# EAGLE design 3 valve front connect (EAGLE 9.2.2)
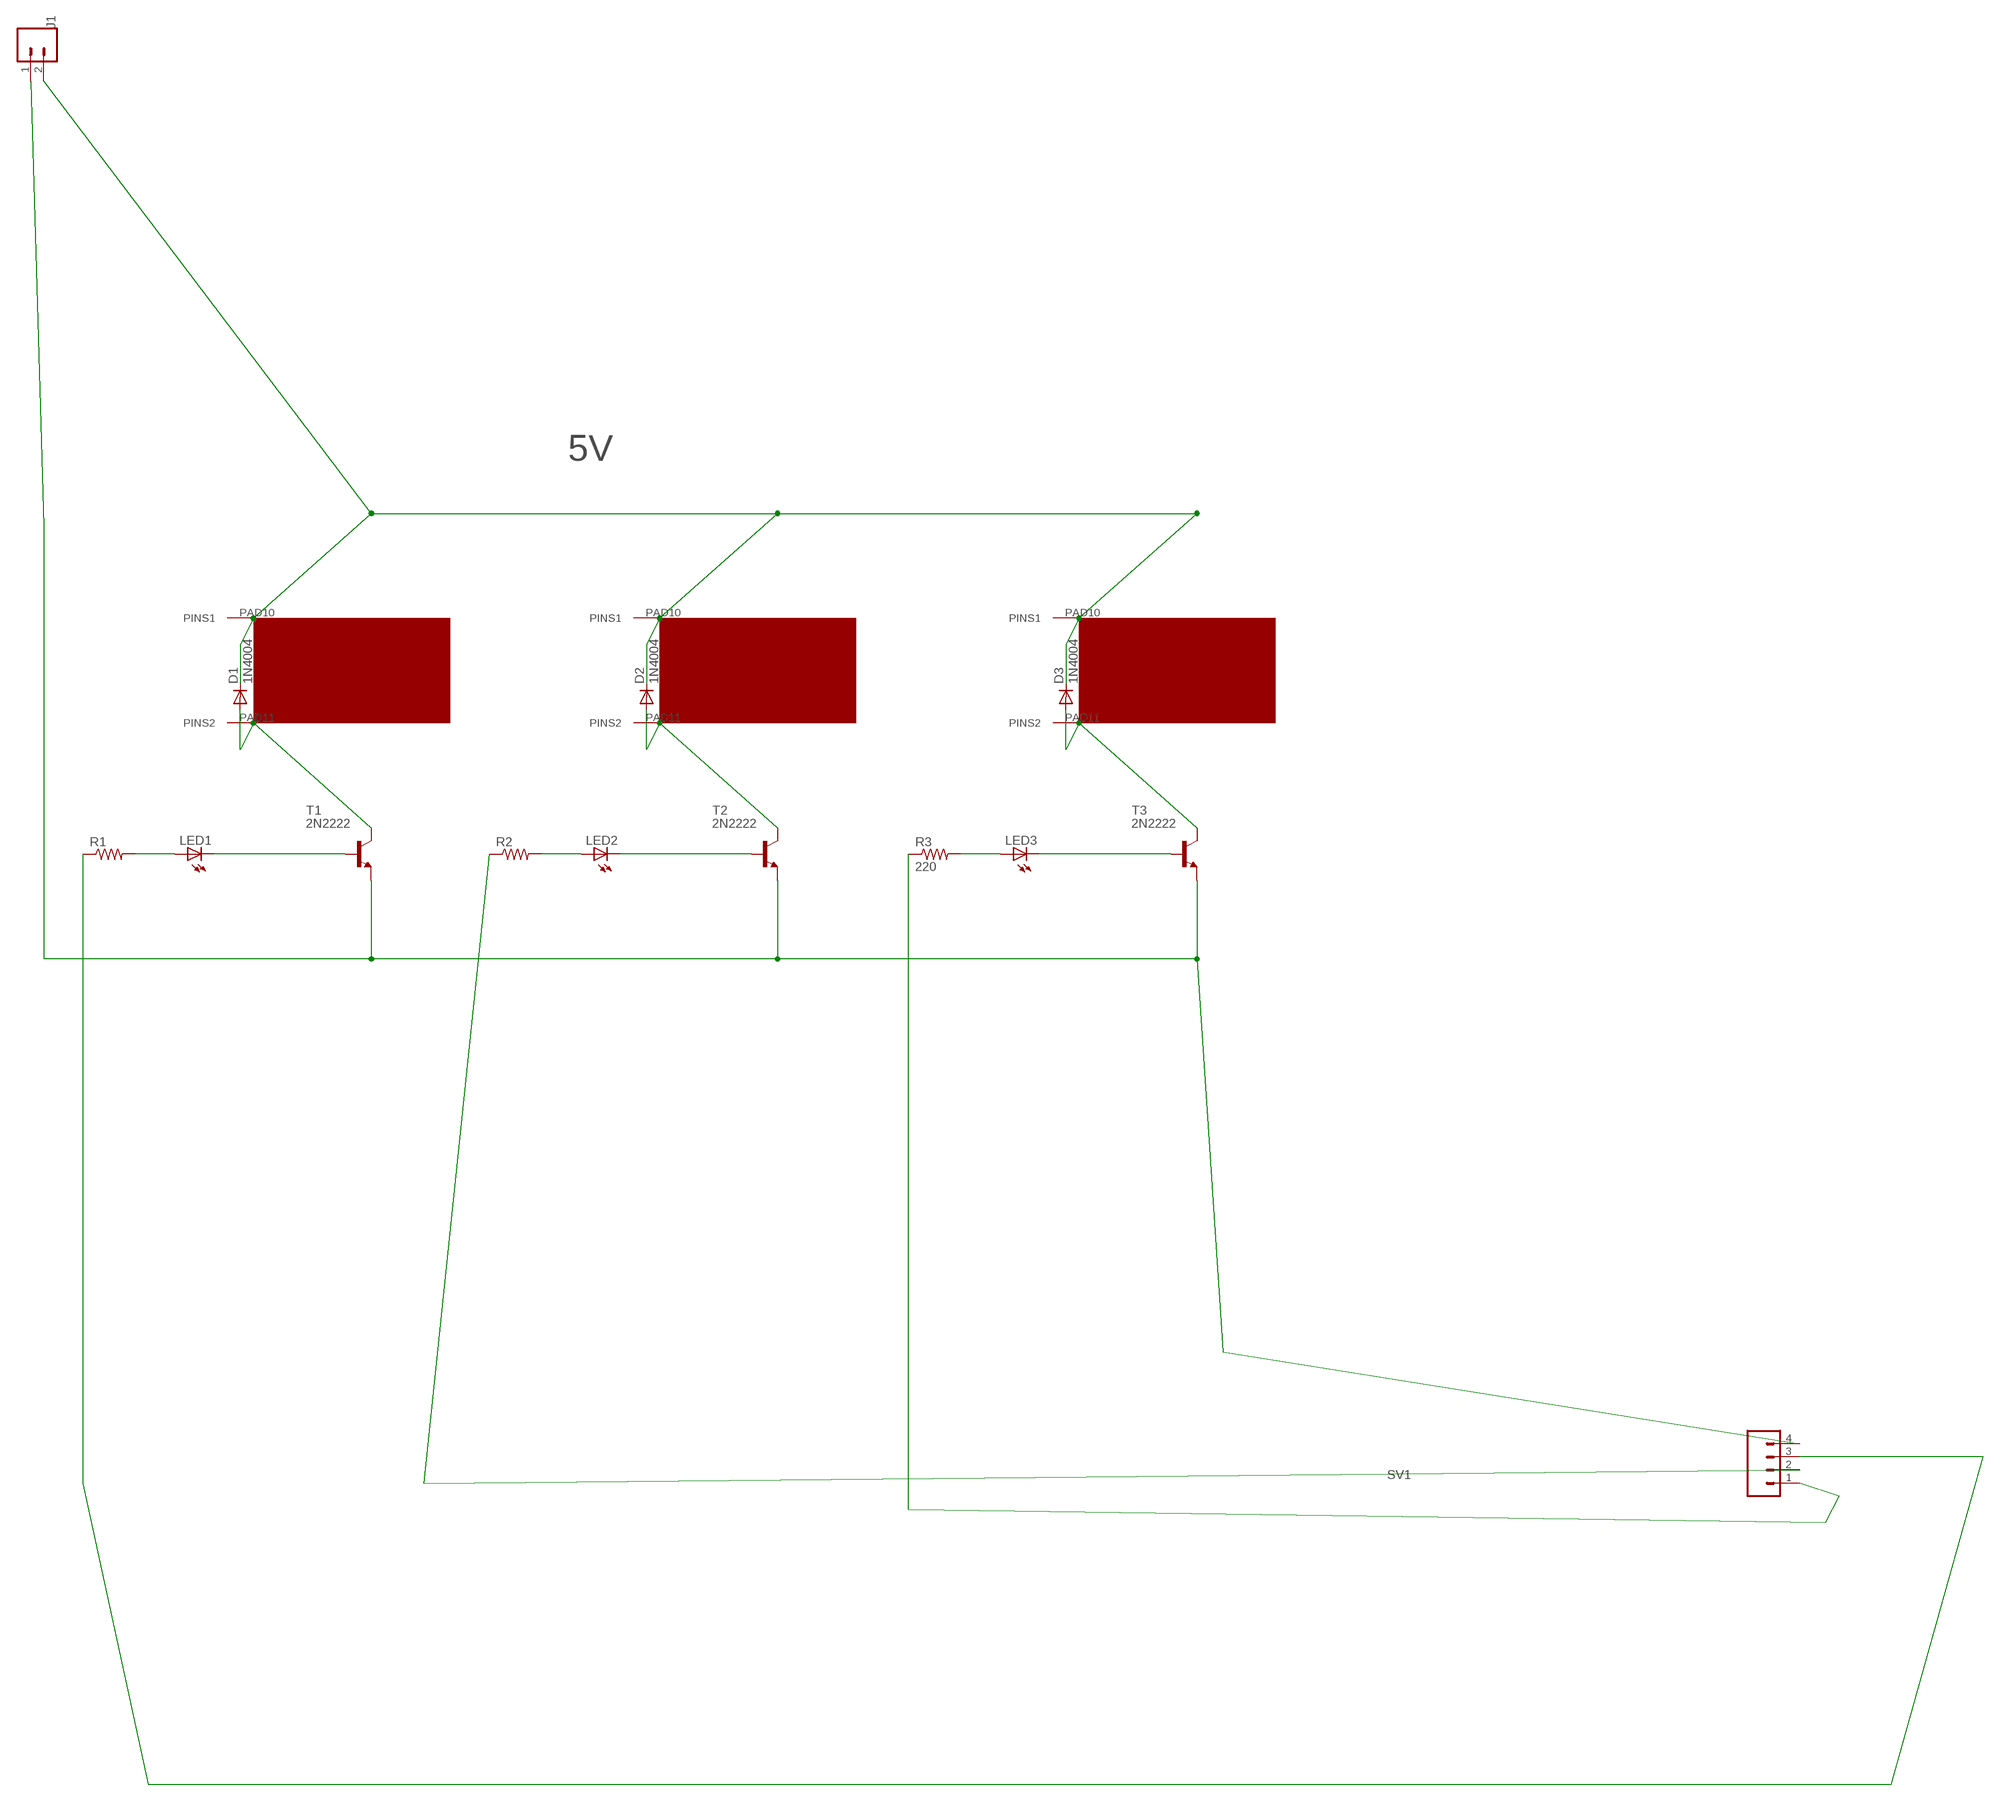
[diagram p0: schematic, sheet 1]

## Parts
D1  1N4004  [DO41-10]
D2  1N4004  [DO41-10]
D3  1N4004  [DO41-10]
J1  CONN_023.5MM  [SCREWTERMINAL-3.5MM-2]
LED1  LED5MM  [LED5MM]
LED2  LED5MM  [LED5MM]
LED3  LED5MM  [LED5MM]
R1  R-US_0207/10  [0207/10]
R2  R-US_0207/10  [0207/10]
R3  220  R-US_0207/10  [0207/10]
SV1  CONN_04  [1X04]
T1  2N2222  [TO92-EBC-OVAL]
T2  2N2222  [TO92-EBC-OVAL]
T3  2N2222  [TO92-EBC-OVAL]
U$1  VALVE  [VALVTEST2]
U$2  VALVE  [VALVTEST2]
VALVE3  VALVE  [VALVTEST2]

## Nets
5V: D1.C D2.C D3.C J1.2 U$1.PAD10(PINS1) U$2.PAD10(PINS1) VALVE3.PAD10(PINS1)
GND: J1.1 SV1.4 T1.E T2.E T3.E
N$1: D1.A T1.C U$1.PAD11(PINS2)
N$2: LED1.K(C) T1.B
N$3: LED1.A R1.2
N$5: D2.A T2.C U$2.PAD11(PINS2)
N$6: LED2.K(C) T2.B
N$7: LED2.A R2.2
N$9: D3.A T3.C VALVE3.PAD11(PINS2)
N$10: LED3.K(C) T3.B
N$11: LED3.A R3.2
N$19: R3.1 SV1.1
N$30: R1.1 SV1.3
N$44: R2.1 SV1.2

## Library data of the parts
D1-D3 = adafruit:1N4004: DIODE General purpose 1N400x type rectifier (With bigger pads) http://www.ladyada.net/library/pcb/eaglelibrary.html
J1 = SparkFun-Connectors:CONN_02: Multi connection point. Often used as Generic Header-pin footprint for 0.1 inch spaced/style header connections On any of the 0.1 inch spaced packages, you can populate with these: Break Away Headers - Straight <https://www.sparkfun.com/products/116> (PRT-00116) Break Away Male Headers - Right Angle <https://www.sparkfun.com/products/553> (PRT-00553) Female Headers <https://www.sparkfun.com/products/115> (PRT-00115) Break Away Headers - Machine Pin <https://www.sparkfun.com/products/117> (PRT-00117) Break Away Female Headers - Swiss Machine Pin <https://www.sparkfun.com/products/743> (PRT-00743) For SCREWTERMINALS and SPRING TERMINALS visit here: Screw Terimnals on SparkFun.com <https://www.sparkfun.com/search/results?term=Screw+Terminals> (5mm/3.5mm/2.54mm spacing) This device is also useful as a general connection point to wire up your design to another part of your project. Our various solder wires solder well into these plated through hole pads. Hook-Up Wire - Assortment (Stranded, 22 AWG) <https://www.sparkfun.com/products/11375> (PRT-11375) Hook-Up Wire - Assortment (Solid Core, 22 AWG) <https://www.sparkfun.com/products/11367> (PRT-11367) View the entire wire category on our website here <https://www.sparkfun.com/categories/141> Special notes: Molex polarized connector foot print use with: PRT-08233 with associated crimp pins and housings. 2.54_SCREWTERM for use with PRT-10571. 3.5mm Screw Terminal footprints for PRT-08084 5mm Screw Terminal footprints for use with PRT-08432; PROD_ID: CONN-08399
LED1-LED3 = adafruit:LED: LED OSRAM: - CHIPLED LG R971, LG N971, LY N971, LG Q971, LY Q971, LO R971, LY R971 LH N974, LH R974 LS Q976, LO Q976, LY Q976 LO Q996 - Hyper CHIPLED LW Q18S LB Q993, LB Q99A, LB R99A - SideLED LS A670, LO A670, LY A670, LG A670, LP A670 LB A673, LV A673, LT A673, LW A673 LH A674 LY A675 LS A676, LA A676, LO A676, LY A676, LW A676 LS A679, LY A679, LG A679 - Hyper Micro SIDELED® LS Y876, LA Y876, LO Y876, LY Y876 LT Y87S - SmartLED LW L88C, LW L88S LB L89C, LB L89S, LG L890 LS L89K, LO L89K, LY L89K LS L896, LA L896, LO L896, LY L896 - TOPLED LS T670, LO T670, LY T670, LG T670, LP T670 LSG T670, LSP T670, LSY T670, LOP T670, LYG T670 LG T671, LOG T671, LSG T671 LB T673, LV T673, LT T673, LW T673 LH T674 LS T676, LA T676, LO T676, LY T676, LB T676, LH T676, LSB T676, LW T676 LB T67C, LV T67C, LT T67C, LS T67K, LO T67K, LY T67K, LW E67C LS E67B, LA E67B, LO E67B, LY E67B, LB E67C, LV E67C, LT E67C LW T67C LS T679, LY T679, LG T679 LS T770, LO T770, LY T770, LG T770, LP T770 LB T773, LV T773, LT T773, LW T773 LH T774 LS E675, LA E675, LY E675, LS T675 LS T776, LA T776, LO T776, LY T776, LB T776 LHGB T686 LT T68C, LB T68C - Hyper Mini TOPLED® LB M676 - Mini TOPLED Santana® LG M470 LS M47K, LO M47K, LY M47K Source: http://www.osram.convergy.de/
R1-R3 = adafruit:R-US_: RESISTOR, American symbol
SV1 = SparkFun-Connectors:CONN_04: Multi connection point. Often used as Generic Header-pin footprint for 0.1 inch spaced/style header connections On any of the 0.1 inch spaced packages, you can populate with these: Break Away Headers - Straight <https://www.sparkfun.com/products/116> (PRT-00116) Break Away Male Headers - Right Angle <https://www.sparkfun.com/products/553> (PRT-00553) Female Headers <https://www.sparkfun.com/products/115> (PRT-00115) Break Away Headers - Machine Pin <https://www.sparkfun.com/products/117> (PRT-00117) Break Away Female Headers - Swiss Machine Pin <https://www.sparkfun.com/products/743> (PRT-00743) For SCREWTERMINALS and SPRING TERMINALS visit here: Screw Terimnals on SparkFun.com <https://www.sparkfun.com/search/results?term=Screw+Terminals> (5mm/3.5mm/2.54mm spacing) This device is also useful as a general connection point to wire up your design to another part of your project. Our various solder wires solder well into these plated through hole pads. Hook-Up Wire - Assortment (Stranded, 22 AWG) <https://www.sparkfun.com/products/11375> (PRT-11375) Hook-Up Wire - Assortment (Solid Core, 22 AWG) <https://www.sparkfun.com/products/11367> (PRT-11367) View the entire wire category on our website here <https://www.sparkfun.com/categories/141> Special notes: Molex polarized connector foot print use with SKU : PRT-08231 with associated crimp pins and housings. 1MM SMD Version SKU: PRT-10208; PROD_ID: CONN-09696
T1-T3 = adafruit:2N2222: NPN TRANSISTOR Big oval pads
U$1 U$2 VALVE3 = local eagle library:VALVE: pn eumatic valve

## Board
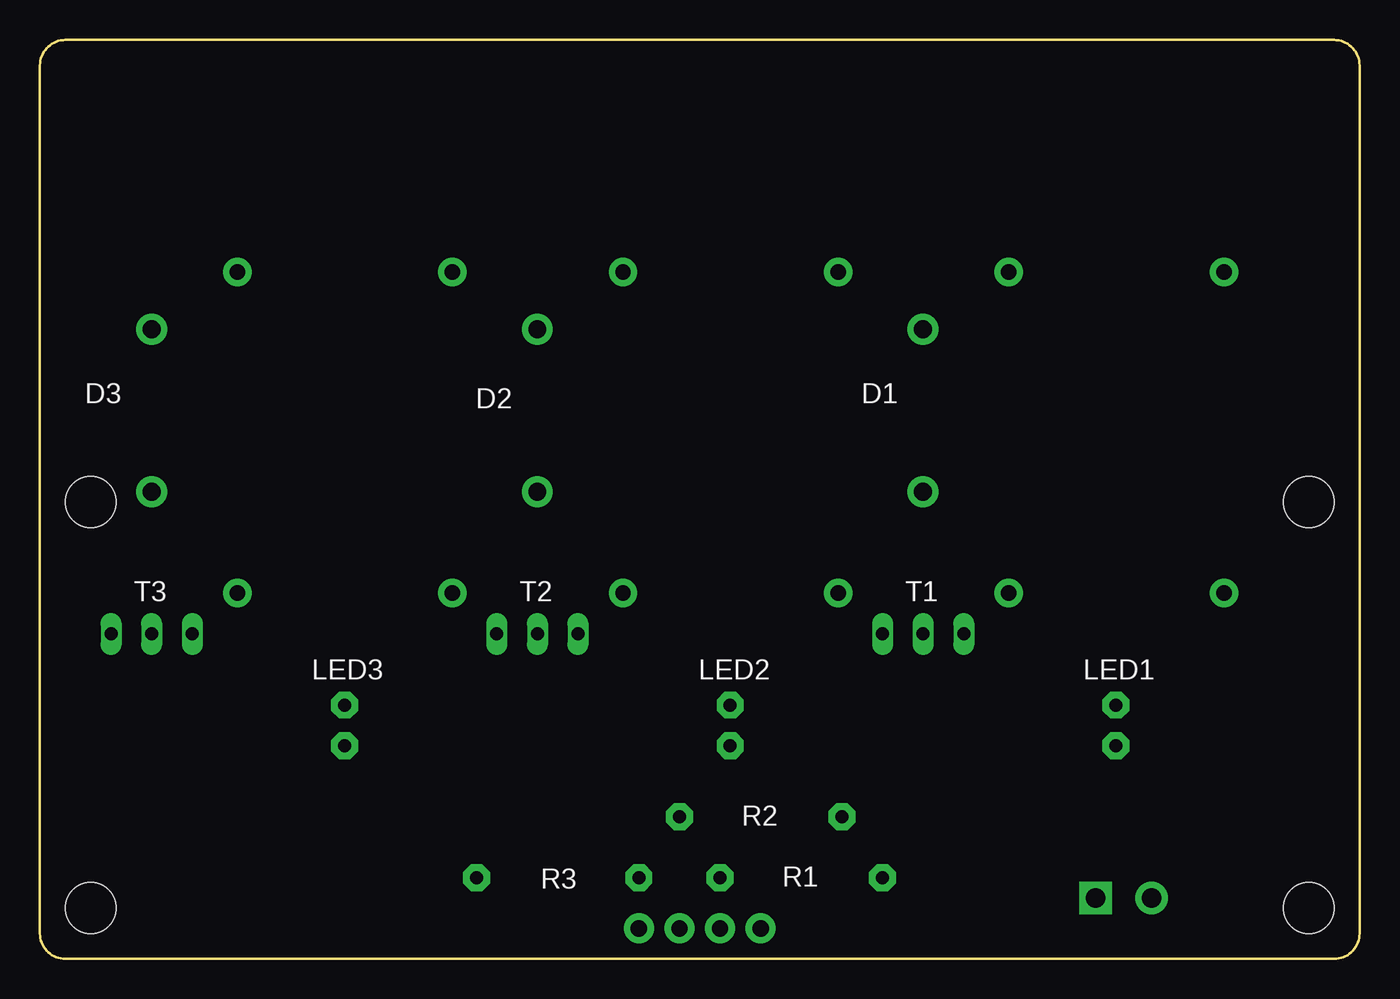
[diagram p1: board, top side]
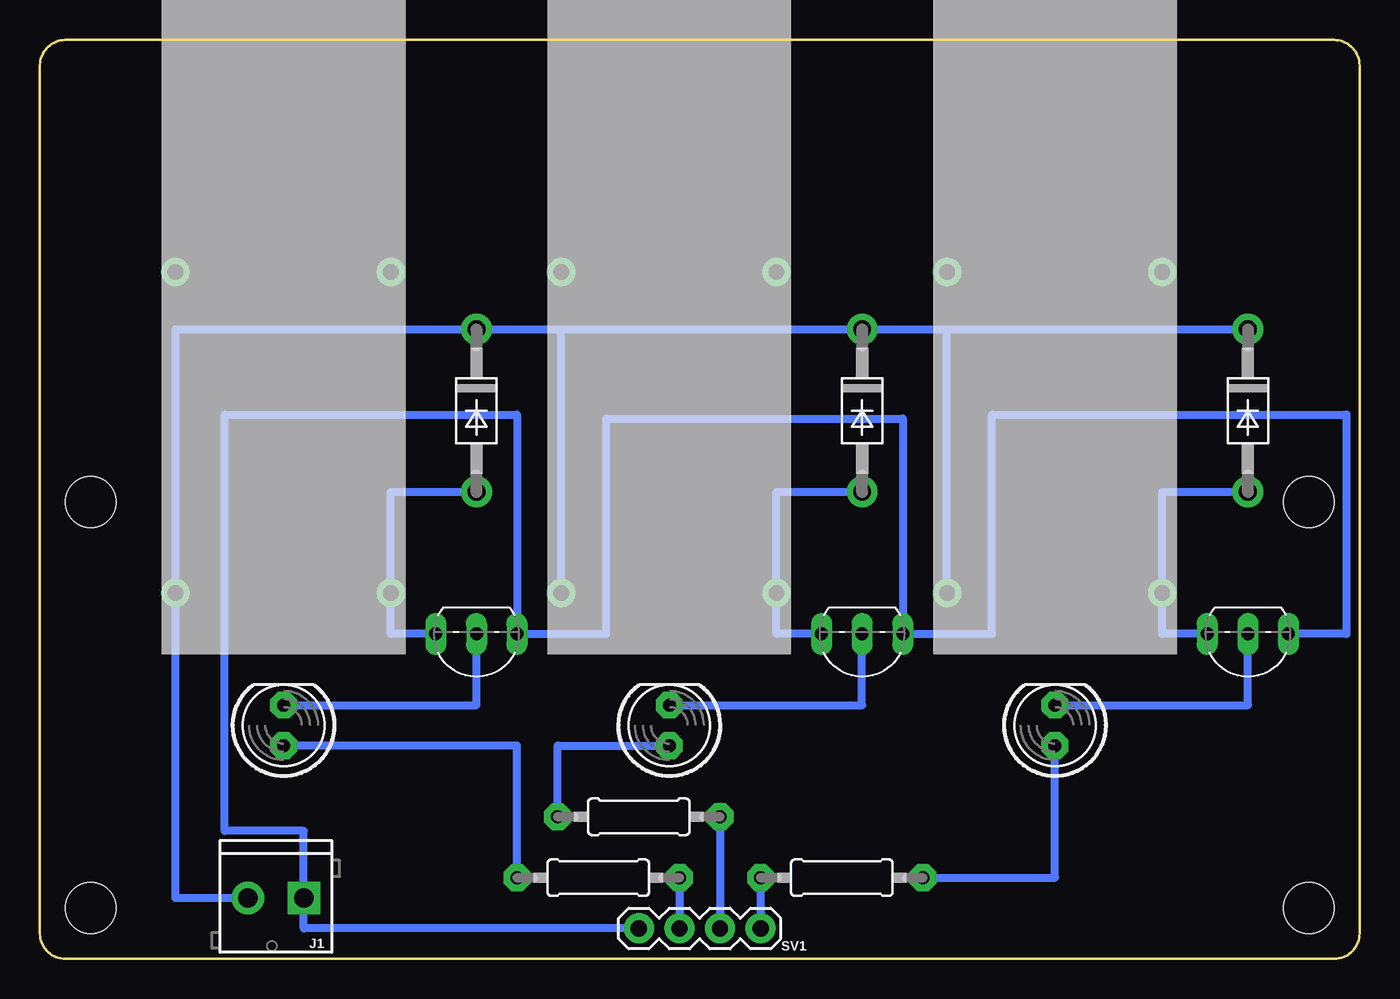
[diagram p2: board, bottom side, seen from below]

Size 82.55 x 57.47 mm. Coordinates in mm from the lower left corner, seen from the top.
Outline: 0,1.59 0,55.88 arc-90 1.59,57.47 80.96,57.47 arc-90 82.55,55.88 82.55,1.59 arc-90 80.96,0 1.59,0 arc-90 0,1.59
Copper layers (1*16): Top 0.035mm / dielectric 1.5mm / Bottom 0.035mm
Design rules "default": minimum track width 6mil, minimum drill 0.35mm, track to track 6mil, track to pad 6mil, pad to pad 6mil, via to via 6mil, smd to smd 6mil, copper to edge 40mil, drill to drill 6mil, minimum pad ring 10mil, minimum via ring 8mil, stop-mask expansion 4mil, vias tented up to drill 0mil, thermal gap 10mil
Holes 3.17 mm at 79.38,3.17 79.38,28.57 3.18,3.17 3.18,28.57

### Footprints (pad centres in the part's own frame; a part is rotated, then mirrored left to right if it is on the bottom)
DO41-10 = drill 1.118 pad 1.93: A 5.08,0; C -5.08,0
SCREWTERMINAL-3.5MM-2 = drill 1.2 pad 2.032 square: 1 0,0 | drill 1.2 pad 2.032: 2 3.5,0
LED5MM = drill 0.813 pad 1.676 octagon: A -1.27,0; K 1.27,0
0207/10 = drill 0.813 pad 1.676 octagon: 1 -5.08,0; 2 5.08,0
1X04 = drill 1.016 pad 1.88: 1 0,0; 2 2.54,0; 3 5.08,0; 4 7.62,0
TO92-EBC-OVAL = drill 0.813 long: B 0,-1.27; C 2.54,-1.27; E -2.54,-1.27
VALVTEST2 = drill 0.965 pad 1.778: PAD10 3.835,-0.864; PAD11 3.835,-14.326; PAD12 23.901,-14.326; PAD13 23.901,-0.864

### Placement (x,y rotation side)
D1  55.25,34.29 270 bottom
D2  31.12,34.29 270 bottom
D3  6.98,34.29 270 bottom
J1  66.04,3.81 180 bottom
LED1  67.31,14.61 90 bottom
LED2  43.18,14.61 90 bottom
LED3  19.05,14.61 90 bottom
R1  47.62,5.08 180 bottom
R2  45.09,8.89 180 bottom
R3  32.39,5.08 0 bottom
SV1  37.47,1.91 180 bottom
T1  55.25,19.05 180 bottom
T2  31.12,19.05 180 bottom
T3  6.98,19.05 180 bottom
U$1  74.93,19.05 90 bottom
U$2  50.8,19.05 90 bottom
VALVE3  26.67,19.05 90 bottom

### Tracks (layer width: path | path; a pad name or v marks a point on that pad's centre or on a via)
5V
  Bottom 0.508: J1.2 74.07,3.81 U$1.PAD10 74.07,39.37 D1.C 49.94,39.37 | 49.94,39.37 D2.C 25.81,39.37 | U$2.PAD10 49.94,39.37 | 25.81,39.37 D3.C | VALVE3.PAD10 25.81,39.37
GND
  Bottom 0.508: SV1.4 66.04,1.91 J1.1 66.04,8 70.99,8 70.99,34.04 52.71,34.04 T1.E 47.12,20.32 47.12,33.78 28.58,33.78 T2.E 22.99,20.32 22.99,34.04 0.83,34.04 0.83,20.32 T3.E
N$1
  Bottom 0.508: T1.C 60.6,20.32 U$1.PAD11 60.6,29.21 D1.A
N$2
  Bottom 0.508: LED1.K 55.25,15.88 T1.B
N$3
  Bottom 0.508: R1.2 52.71,13.34 LED1.A
N$5
  Bottom 0.508: T2.C 36.47,20.32 U$2.PAD11 36.47,29.21 D2.A
N$6
  Bottom 0.508: LED2.K 31.12,15.88 T2.B
N$7
  Bottom 0.508: R2.2 50.17,13.34 LED2.A
N$9
  Bottom 0.508: T3.C 12.34,20.32 VALVE3.PAD11 12.34,29.21 D3.A
N$10
  Bottom 0.508: LED3.K 6.98,15.88 T3.B
N$11
  Bottom 0.508: R3.2 19.05,5.08 LED3.A
N$19
  Bottom 0.508: R3.1 SV1.1
N$30
  Bottom 0.508: R1.1 SV1.3
N$44
  Bottom 0.508: R2.1 SV1.2